# EAGLE design m220print (EAGLE 4.11)
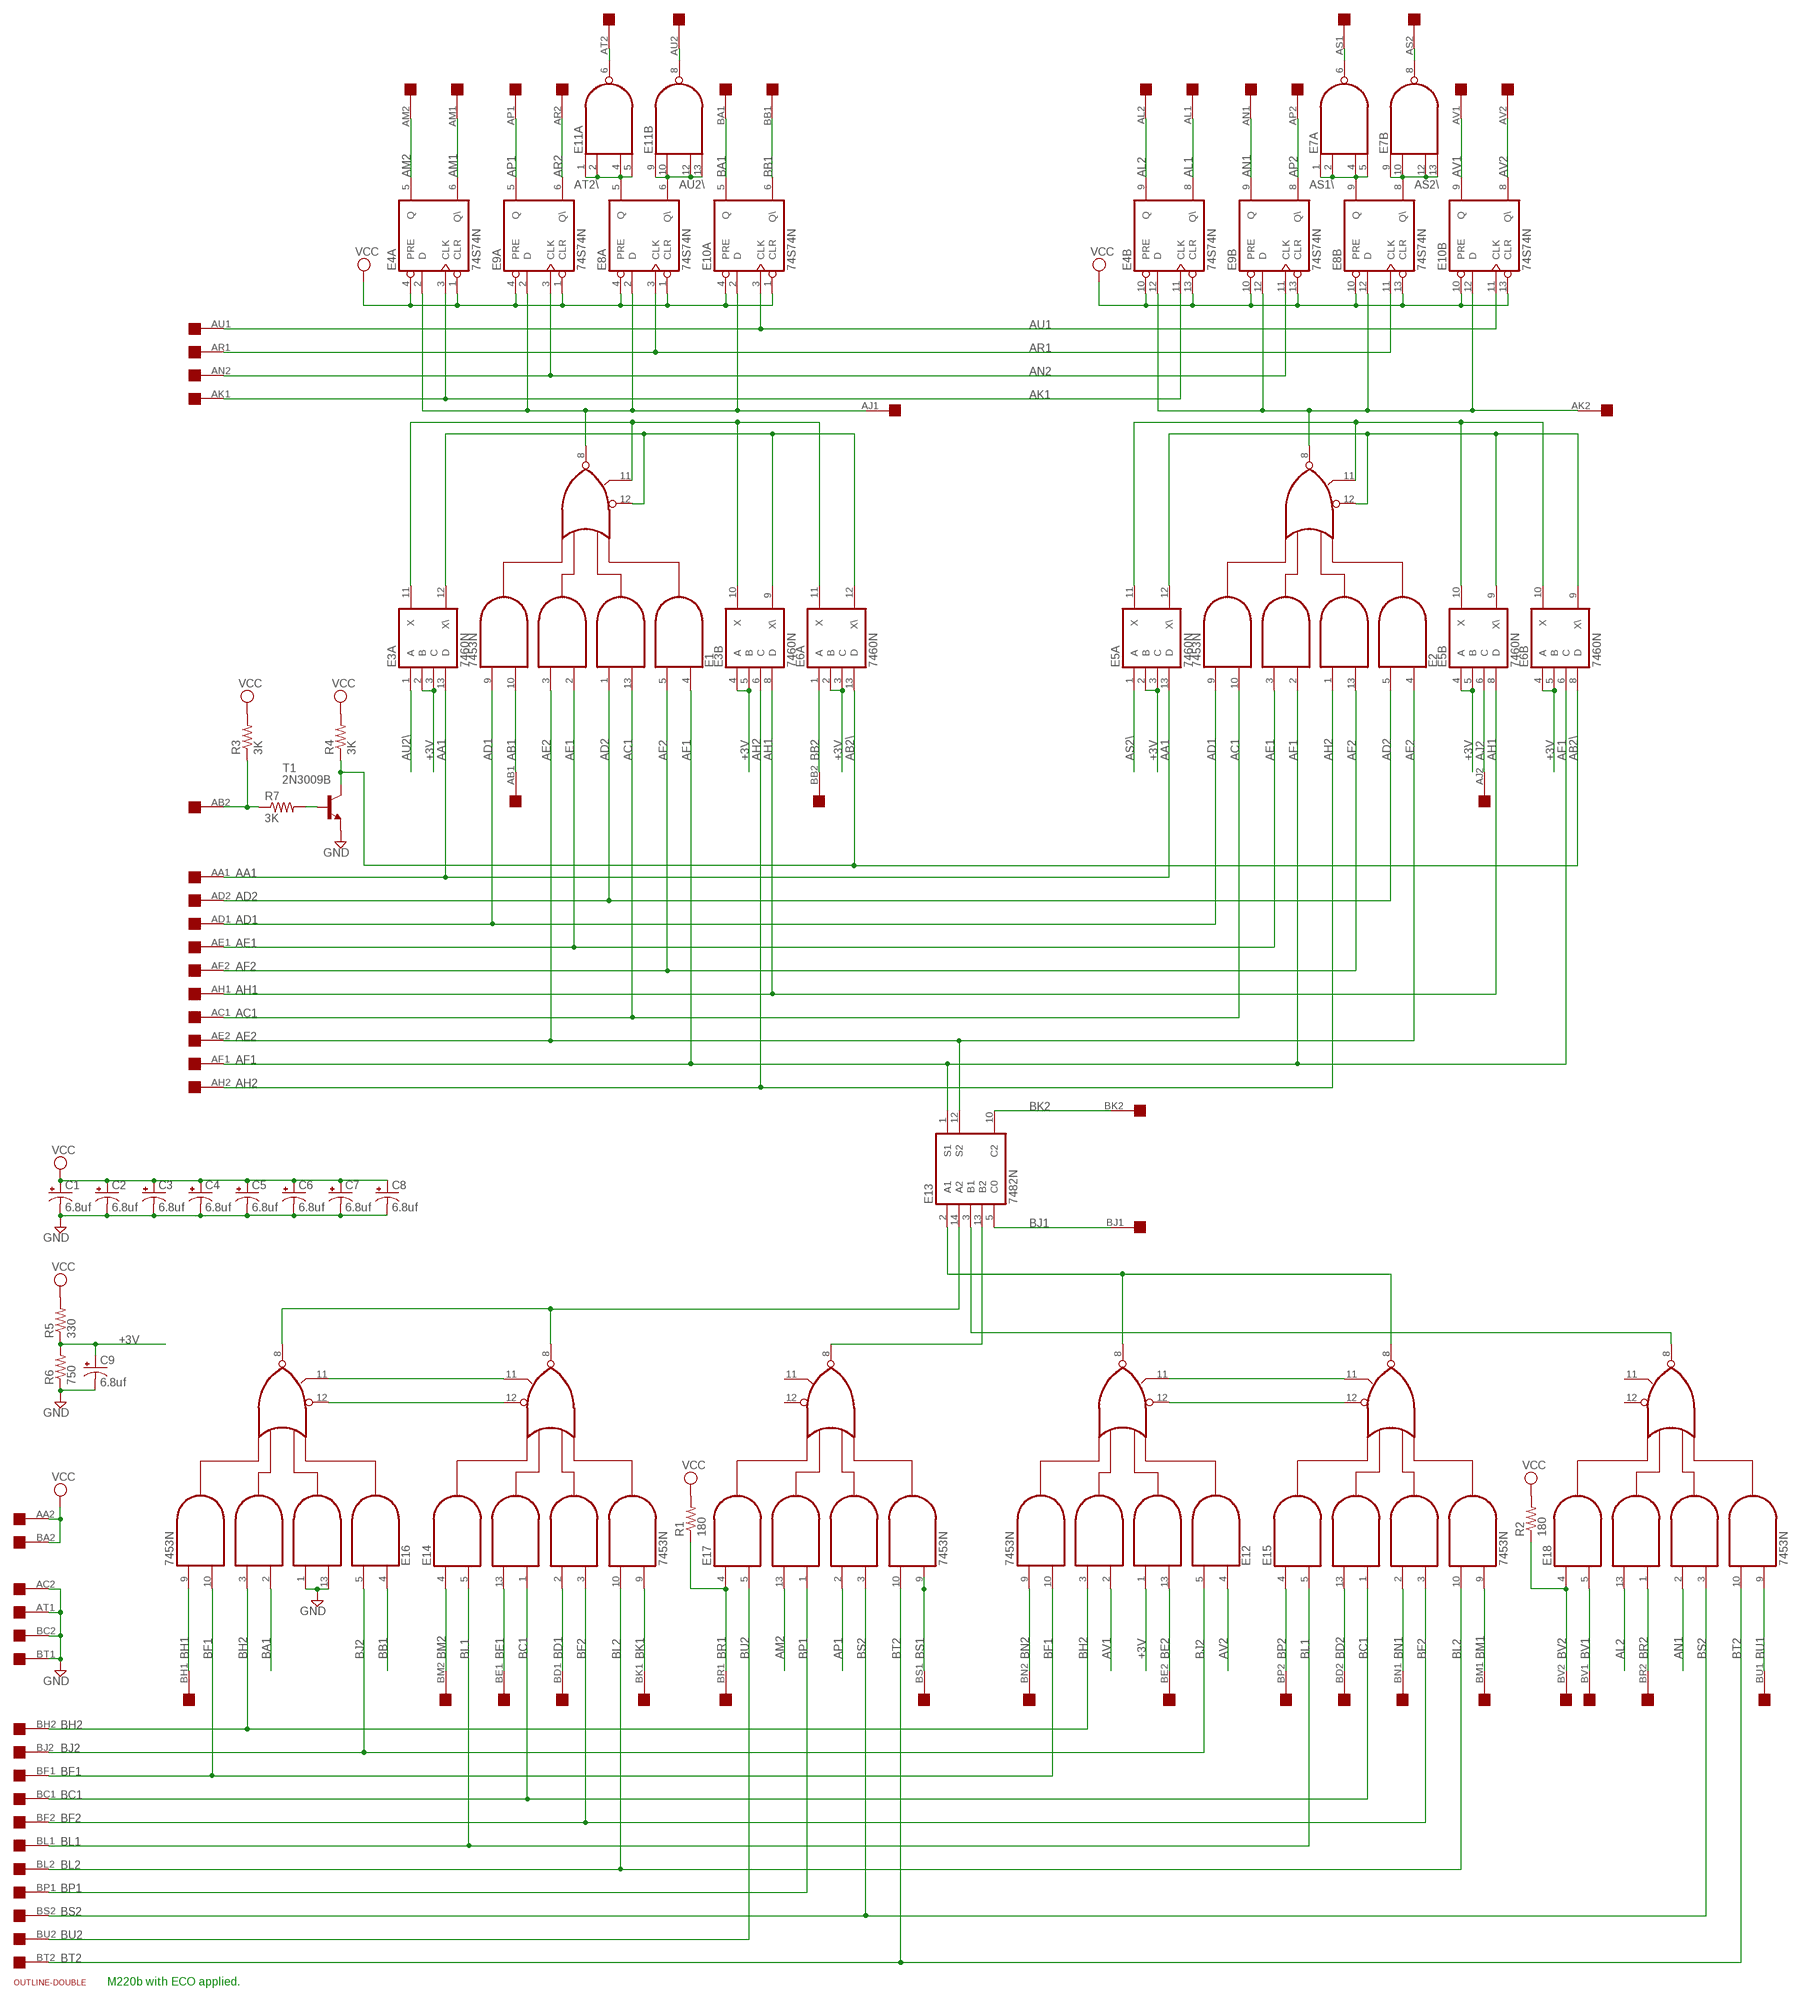
[diagram p0: schematic, sheet 1]

## Parts
C1  6.8uf  CPOL-USE15-5AXIAL  [E15-5]
C2  6.8uf  CPOL-USE15-5AXIAL  [E15-5]
C3  6.8uf  CPOL-USE15-5AXIAL  [E15-5]
C4  6.8uf  CPOL-USE15-5AXIAL  [E15-5]
C5  6.8uf  CPOL-USE15-5AXIAL  [E15-5]
C6  6.8uf  CPOL-USE15-5AXIAL  [E15-5]
C7  6.8uf  CPOL-USE15-5AXIAL  [E15-5]
C8  6.8uf  CPOL-USE15-5AXIAL  [E15-5]
C9  6.8uf  CPOL-USE15-5AXIAL  [E15-5]
E1  7453N  [DIL14]
E2  7453N  [DIL14]
E3  7460N  [DIL14]
E4  74S74N  [DIL14]
E5  7460N  [DIL14]
E6  7460N  [DIL14]
E7  74S20N  [DIL14]
E8  74S74N  [DIL14]
E9  74S74N  [DIL14]
E10  74S74N  [DIL14]
E11  74S20N  [DIL14]
E12  7453N  [DIL14]
E13  7482N  [DIL14]
E14  7453N  [DIL14]
E15  7453N  [DIL14]
E16  7453N  [DIL14]
E17  7453N  [DIL14]
E18  7453N  [DIL14]
R1  180  R-US_0207/10  [0207/10]
R2  180  R-US_0207/10  [0207/10]
R3  3K  R-US_0207/10  [0207/10]
R4  3K  R-US_0207/10  [0207/10]
R5  330  R-US_0207/10  [0207/10]
R6  750  R-US_0207/10  [0207/10]
R7  3K  R-US_0207/10  [0207/10]
T1  2N3009B  2N1613  [TO5]
U$1  DOUBLE  [EDGE-CON4]
U$2  OUTLINE-DOUBLE  [DOUBLE]

## Nets
+3V: C9.+ E3.2(A:B) E3.3(A:C) E3.4(B:A) E3.5(B:B) E5.2(A:B) E5.3(A:C) E5.4(B:A) E5.5(B:B) E6.2(A:B) E6.3(A:C) E6.4(B:A) E6.5(B:B) E12.1(I4) R5.1 R6.2
AA1: E3.13(A:D) E5.13(A:D) U$1.AA1
AB1: E1.10(I7) U$1.AB1
AB2: R3.1 R7.1 U$1.AB2
AB2\: E6.8(B:D) E6.13(A:D) R4.1 T1.3(C)
AC1: E1.13(I3) E2.10(I7) U$1.AC1
AD1: E1.9(I8) E2.9(I8) U$1.AD1
AD2: E1.1(I4) E2.5(I2) U$1.AD2
AE1: E1.2(I5) E2.3(I6) U$1.AE1
AE2: E1.3(I6) E2.4(I1) E13.12(S2) U$1.AE2
AF1: E1.4(I1) E2.2(I5) E6.6(B:C) E13.1(S1) U$1.AF1
AF2: E1.5(I2) E2.13(I3) U$1.AF2
AH1: E3.8(B:D) E5.8(B:D) U$1.AH1
AH2: E2.1(I4) E3.6(B:C) U$1.AH2
AJ1: E1.8(O) E4.2(A:D) E8.2(A:D) E9.2(A:D) E10.2(A:D) U$1.AJ1
AJ2: E5.6(B:C) U$1.AJ2
AK1: E4.3(A:CLK) E4.11(B:CLK) U$1.AK1
AK2: E2.8(O) E4.12(B:D) E8.12(B:D) E9.12(B:D) E10.12(B:D) U$1.AK2
AL1: E4.8(B:Q\) U$1.AL1
AL2: E4.9(B:Q) E18.13(I3) U$1.AL2
AM1: E4.6(A:Q\) U$1.AM1
AM2: E4.5(A:Q) E17.13(I3) U$1.AM2
AN1: E9.9(B:Q) E18.2(I5) U$1.AN1
AN2: E9.3(A:CLK) E9.11(B:CLK) U$1.AN2
AP1: E9.5(A:Q) E17.2(I5) U$1.AP1
AP2: E9.8(B:Q\) U$1.AP2
AR1: E8.3(A:CLK) E8.11(B:CLK) U$1.AR1
AR2: E9.6(A:Q\) U$1.AR2
AS1: E7.6(A:O) U$1.AS1
AS1\: E7.1(A:I0) E7.2(A:I1) E7.4(A:I2) E7.5(A:I3) E8.9(B:Q)
AS2: E7.8(B:O) U$1.AS2
AS2\: E5.1(A:A) E7.9(B:I0) E7.10(B:I1) E7.12(B:I2) E7.13(B:I3) E8.8(B:Q\)
AT2: E11.6(A:O) U$1.AT2
AT2\: E8.5(A:Q) E11.1(A:I0) E11.2(A:I1) E11.4(A:I2) E11.5(A:I3)
AU1: E10.3(A:CLK) E10.11(B:CLK) U$1.AU1
AU2: E11.8(B:O) U$1.AU2
AU2\: E3.1(A:A) E8.6(A:Q\) E11.9(B:I0) E11.10(B:I1) E11.12(B:I2) E11.13(B:I3)
AV1: E10.9(B:Q) E12.2(I5) U$1.AV1
AV2: E10.8(B:Q\) E12.4(I1) U$1.AV2
BA1: E10.5(A:Q) E16.2(I5) U$1.BA1
BB1: E10.6(A:Q\) E16.4(I1) U$1.BB1
BB2: E6.1(A:A) U$1.BB2
BC1: E14.1(I4) E15.1(I4) U$1.BC1
BD1: E14.2(I5) U$1.BD1
BD2: E15.13(I3) U$1.BD2
BE1: E14.13(I3) U$1.BE1
BE2: E12.13(I3) U$1.BE2
BF1: E12.10(I7) E16.10(I7) U$1.BF1
BF2: E14.3(I6) E15.3(I6) U$1.BF2
BH1: E16.9(I8) U$1.BH1
BH2: E12.3(I6) E16.3(I6) U$1.BH2
BJ1: E13.5(C0) U$1.BJ1
BJ2: E12.5(I2) E16.5(I2) U$1.BJ2
BK1: E14.9(I8) U$1.BK1
BK2: E13.10(C2) U$1.BK2
BL1: E14.5(I2) E15.5(I2) U$1.BL1
BL2: E14.10(I7) E15.10(I7) U$1.BL2
BM1: E15.9(I8) U$1.BM1
BM2: E14.4(I1) U$1.BM2
BN1: E15.2(I5) U$1.BN1
BN2: E12.9(I8) U$1.BN2
BP1: E17.1(I4) U$1.BP1
BP2: E15.4(I1) U$1.BP2
BR1: E17.4(I1) R1.1 U$1.BR1
BR2: E18.1(I4) U$1.BR2
BS1: E17.9(I8) U$1.BS1
BS2: E17.3(I6) E18.3(I6) U$1.BS2
BT2: E17.10(I7) E18.10(I7) U$1.BT2
BU1: E18.9(I8) U$1.BU1
BU2: E17.5(I2) U$1.BU2
BV1: E18.5(I2) U$1.BV1
BV2: E18.4(I1) R2.1 U$1.BV2
GND: C1.- C2.- C3.- C4.- C5.- C6.- C7.- C8.- C9.- E16.1(I4) E16.13(I3) R6.1 T1.1(E) U$1.AC2 U$1.AT1 U$1.BC2 U$1.BT1
N$2: E12.12(I9) E15.12(I9)
N$3: R7.2 T1.2(B)
N$4: E12.11(I10) E15.11(I10)
N$5: E13.14(A2) E14.8(O) E16.8(O)
N$6: E14.11(I10) E16.11(I10)
N$7: E14.12(I9) E16.12(I9)
N$8: E12.8(O) E13.2(A1) E15.8(O)
N$9: E2.12(I9) E5.9(B:X\) E5.12(A:X\) E6.9(B:X\)
N$10: E1.12(I9) E3.9(B:X\) E3.12(A:X\) E6.12(A:X\)
N$11: E2.11(I10) E5.10(B:X) E5.11(A:X) E6.10(B:X)
N$12: E13.13(B2) E17.8(O)
N$13: E1.11(I10) E3.10(B:X) E3.11(A:X) E6.11(A:X)
N$14: E13.3(B1) E18.8(O)
VCC: C1.+ C2.+ C3.+ C4.+ C5.+ C6.+ C7.+ C8.+ E4.1(A:CLR) E4.4(A:PRE) E4.10(B:PRE) E4.13(B:CLR) E8.1(A:CLR) E8.4(A:PRE) E8.10(B:PRE) E8.13(B:CLR) E9.1(A:CLR) E9.4(A:PRE) E9.10(B:PRE) E9.13(B:CLR) E10.1(A:CLR) E10.4(A:PRE) E10.10(B:PRE) E10.13(B:CLR) R1.2 R2.2 R3.2 R4.2 R5.2 U$1.AA2 U$1.BA2
Unconnected: E17.11(I10) E17.12(I9) E18.11(I10) E18.12(I9)

## Notes on the sheet
- M220b with ECO applied.

## Power pins joined to a net without a drawn wire
GND: E1.7(GND) E2.7(GND) E3.7(P:GND) E4.7(P:GND) E5.7(P:GND) E6.7(P:GND) E7.7(P:GND) E8.7(P:GND) E9.7(P:GND) E10.7(P:GND) E11.7(P:GND) E12.7(GND) E13.7(GND) E14.7(GND) E15.7(GND) E16.7(GND) E17.7(GND) E18.7(GND)
VCC: E1.14(VCC) E2.14(VCC) E3.14(P:VCC) E4.14(P:VCC) E5.14(P:VCC) E6.14(P:VCC) E7.14(P:VCC) E8.14(P:VCC) E9.14(P:VCC) E10.14(P:VCC) E11.14(P:VCC) E12.14(VCC) E13.4(VCC) E14.14(VCC) E15.14(VCC) E16.14(VCC) E17.14(VCC) E18.14(VCC)

## Library data of the parts
C1-C9 = rcl:CPOL-US: POLARIZED CAPACITOR, American symbol
E1 E2 E12 E14-E18 = 74xxN:74*53: 4-2-3-2 input AND OR INVERTER gates
E3 E5 E6 = 74xx-jameco:74*60: Dual 4-input EXPANDER
E4 E8-E10 = 74xx-us:74*74: Dual D type positive edge triggered FLIP FLOP, preset and clear
E7 E11 = 74xx-jameco:74*20: Dual 4-input NAND gate
E13 = 74xx-eu:74*82: 2-bit binary full ADDER
R1-R7 = rcl:R-US_: RESISTOR, American symbol
T1 = transistor:2N1613: NPN TRANSISTOR
U$1 = dec-con:DOUBLE: Double-Height DEC board
U$2 = dec-con:OUTLINE-*: Board outlines for DEC boards.

## Board
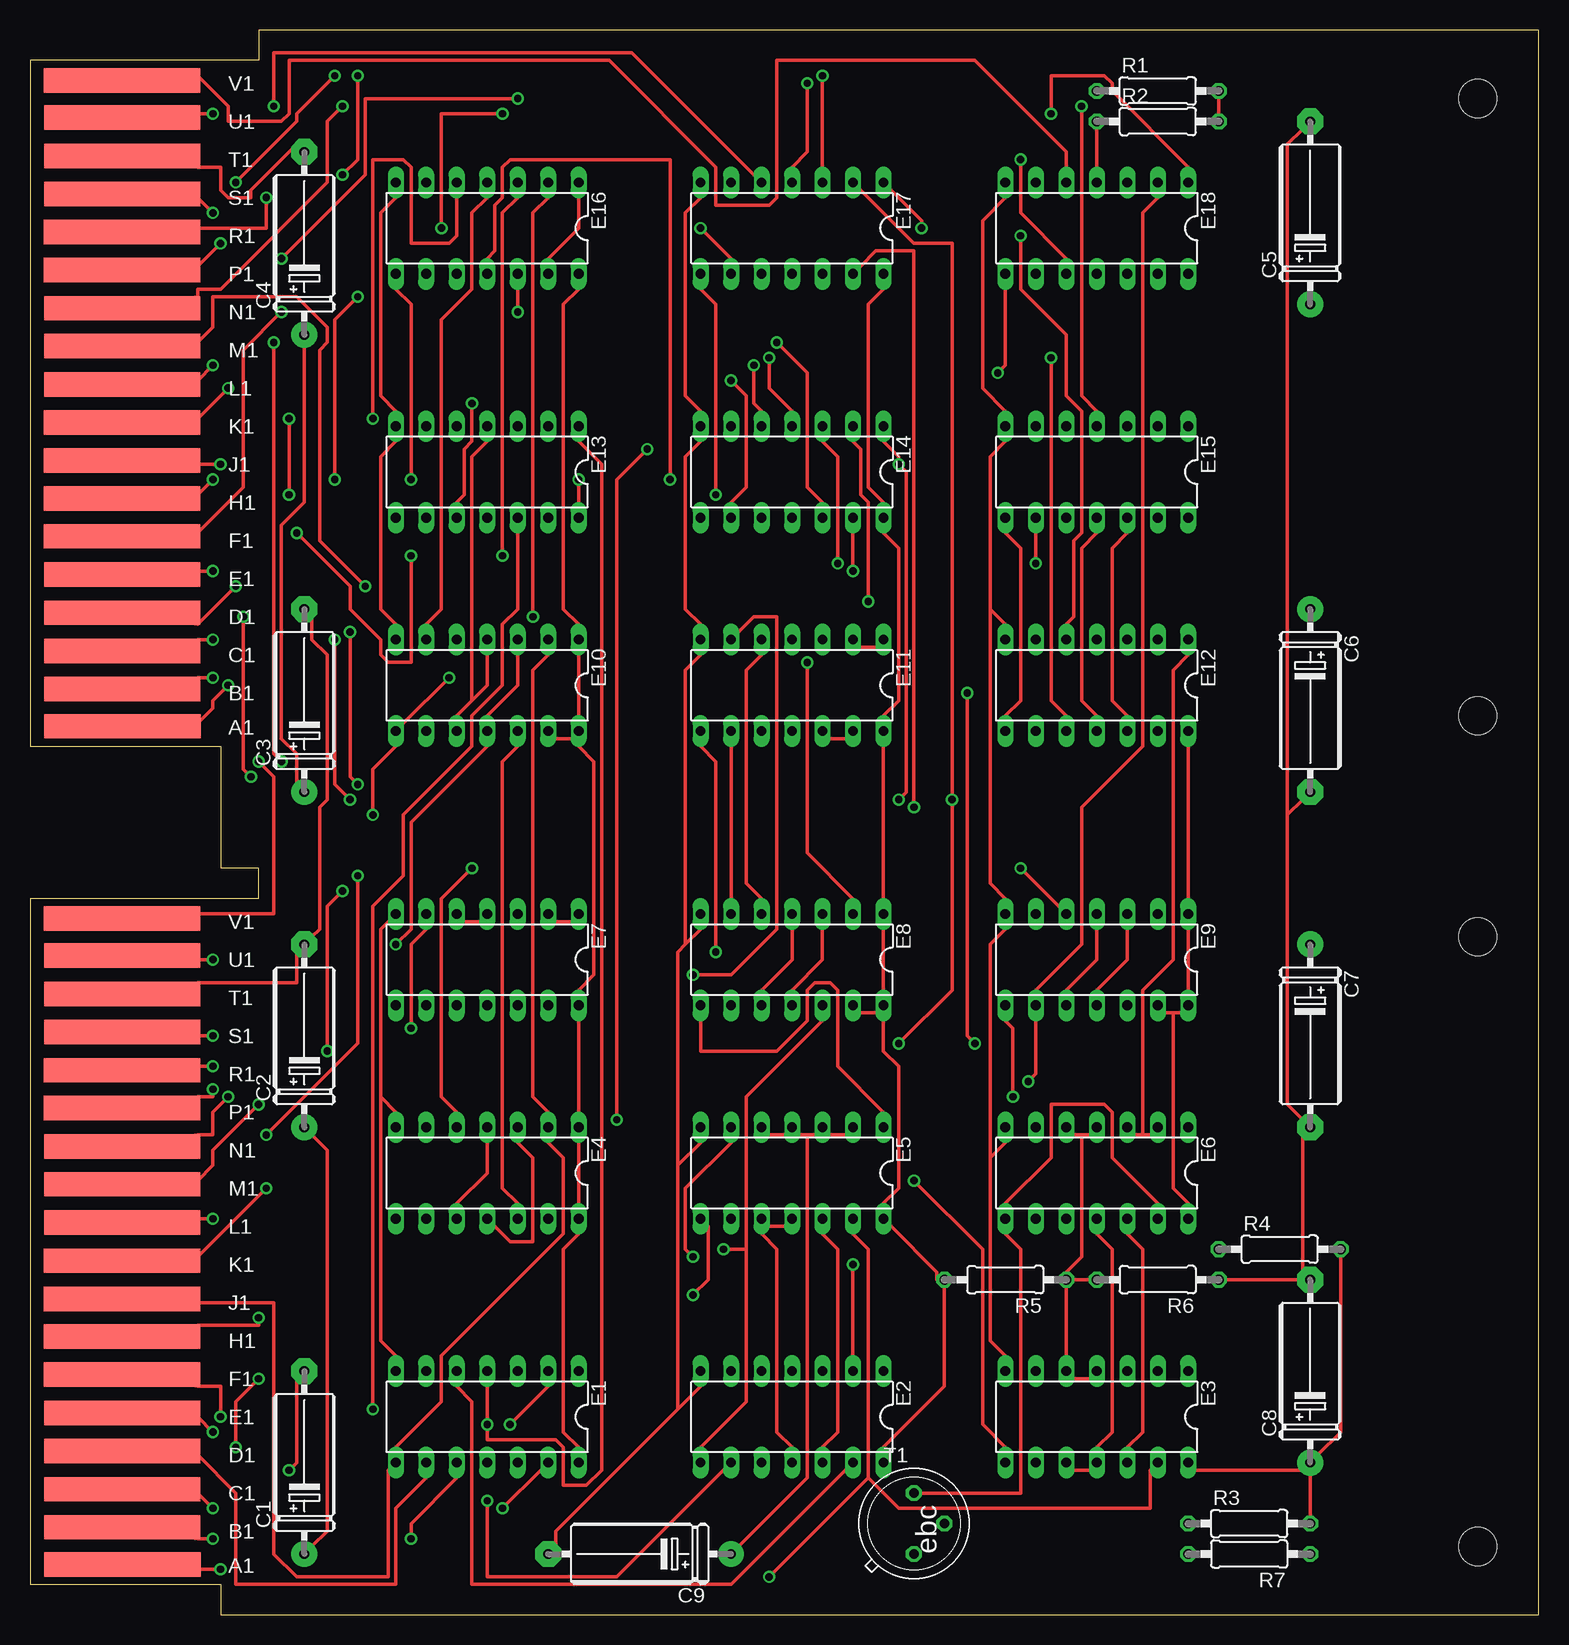
[diagram p1: board, top side]
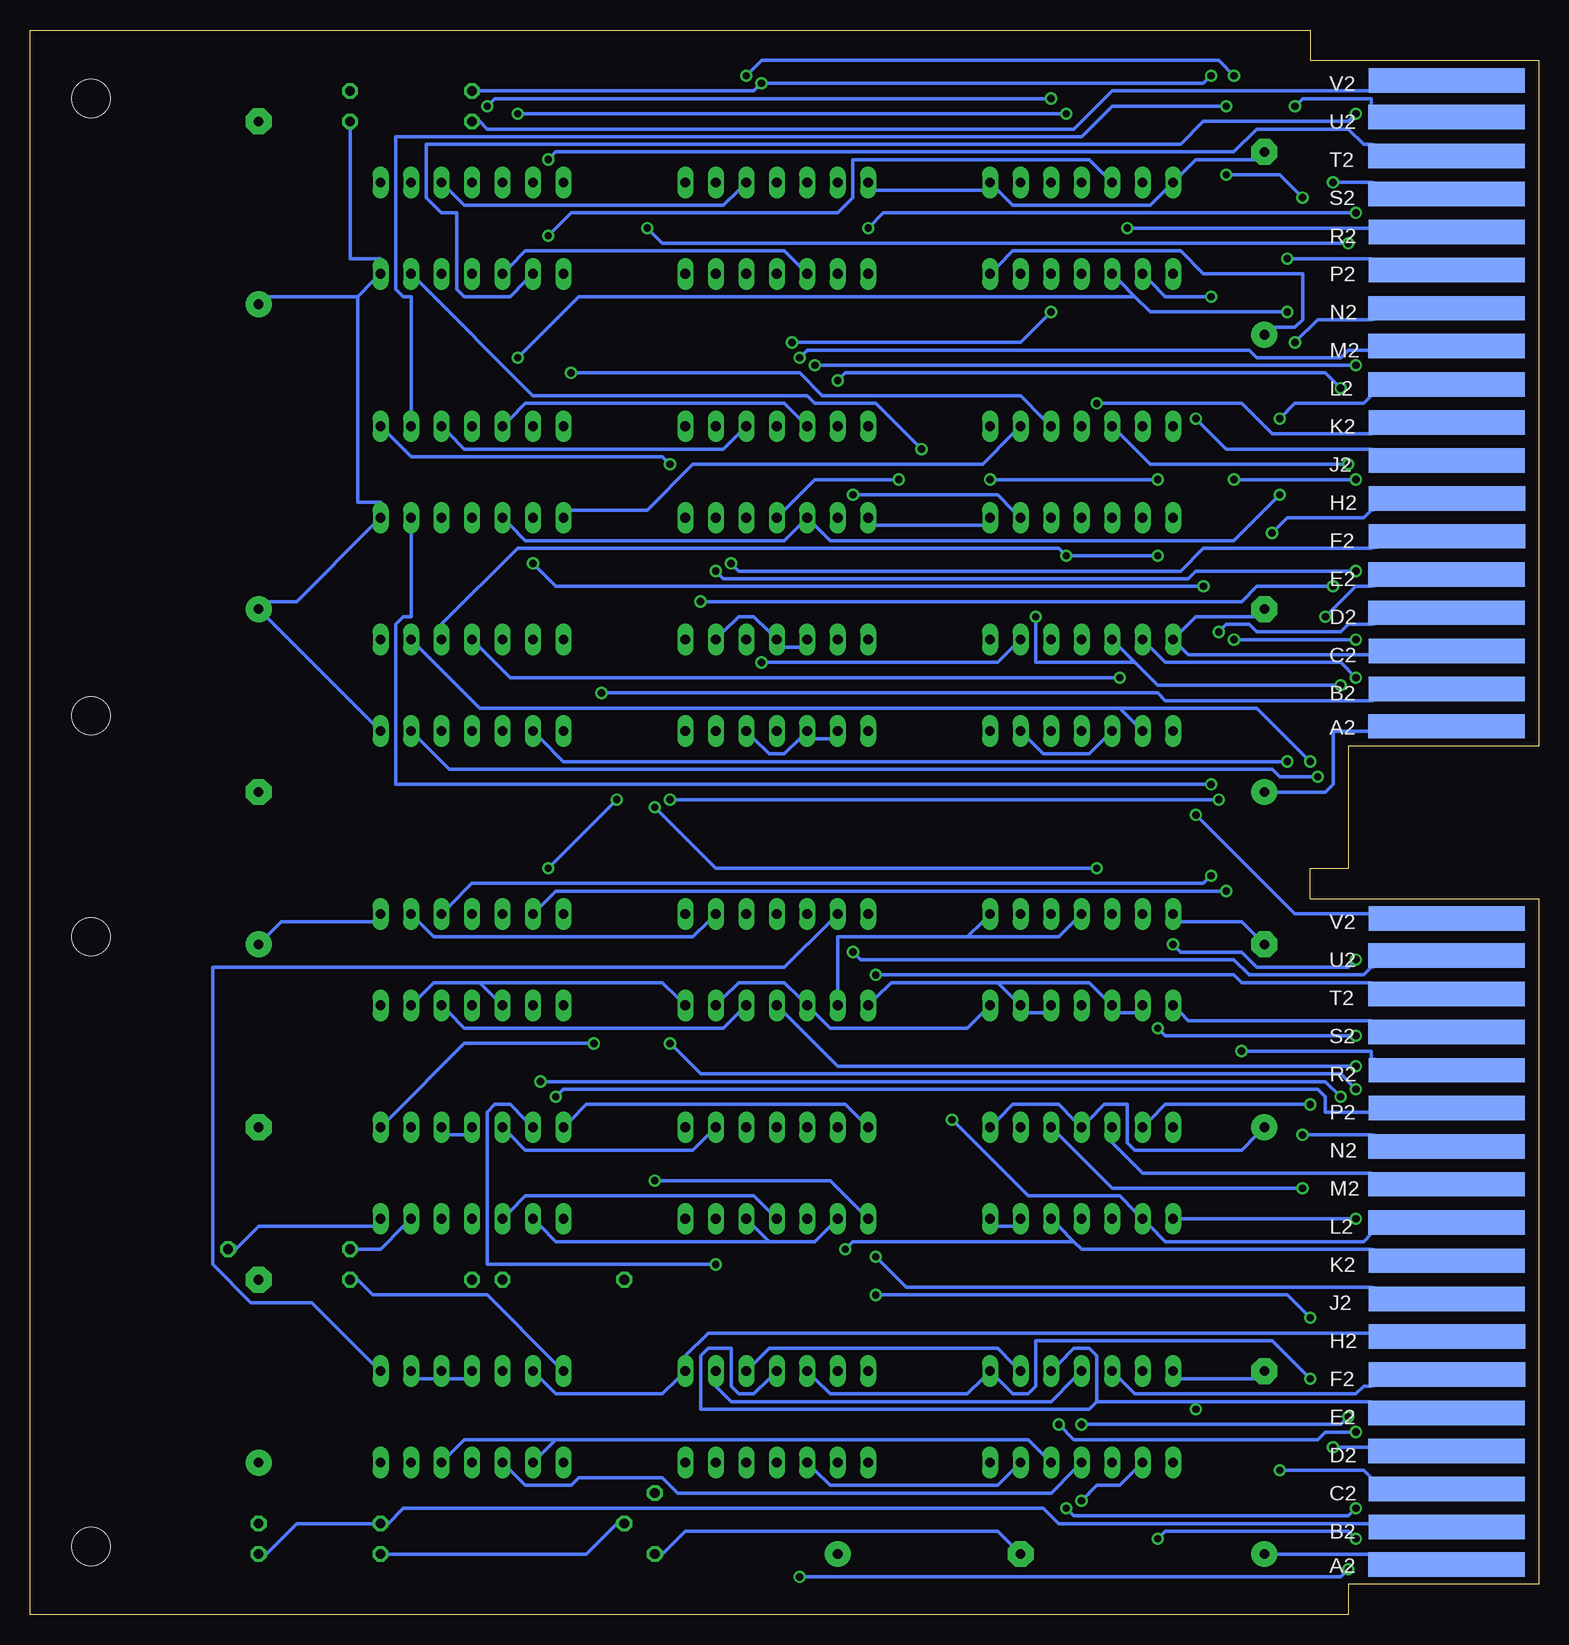
[diagram p2: board, bottom side, seen from below]

Size 125.73 x 132.08 mm. Coordinates in mm from the lower left corner, seen from the top.
Copper layers (1*16): Top 0.035mm / dielectric 1.5mm / Bottom 0.035mm
Design rules "olimex10mil": minimum track width 12mil, minimum drill 24mil, track to track 12mil, track to pad 12mil, pad to pad 12mil, via to via 12mil, smd to smd 10mil, copper to edge 25mil, drill to drill 10mil, minimum pad ring 10mil, minimum via ring 8mil, stop-mask expansion 0mil, vias tented up to drill 0mil, thermal gap 10mil

### Footprints (pad centres in the part's own frame; a part is rotated, then mirrored left to right if it is on the bottom)
E15-5 = drill 0.813 pad 2.159 round: + -7.62,0 | drill 0.813 pad 2.159 octagon: - 7.62,0
DIL14 = drill 0.813 long: 1 -7.62,-3.81; 2 -5.08,-3.81; 3 -2.54,-3.81; 4 0,-3.81; 5 2.54,-3.81; 6 5.08,-3.81; 7 7.62,-3.81; 8 7.62,3.81; 9 5.08,3.81; 10 2.54,3.81; 11 0,3.81; 12 -2.54,3.81; 13 -5.08,3.81; 14 -7.62,3.81
0207/10 = drill 0.813 octagon: 1 -5.08,0; 2 5.08,0
TO5 = drill 0.813 octagon: 1 0,-2.54; 2 2.54,0; 3 0,2.54
EDGE-CON4 = smd 13.017 x 2.032: AA1 7.709,4.207; AB1 7.684,7.312; AC1 7.684,10.474; AD1 7.684,13.665; AE1 7.693,16.84; AF1 7.668,20.041; AH1 7.668,23.19; AJ1 7.668,26.34; AK1 7.668,29.515; AL1 7.693,32.69; AM1 7.693,35.89; AN1 7.693,39.04; AP1 7.668,42.24; AR1 7.668,45.39; AS1 7.693,48.565; AT1 7.693,51.74; AU1 7.693,54.94; AV1 7.668,58.026; BA1 7.709,74.057; BB1 7.684,77.162; BC1 7.684,80.324; BD1 7.684,83.515; BE1 7.693,86.69; BF1 7.668,89.891; BH1 7.668,93.04; BJ1 7.668,96.19; BK1 7.668,99.365; BL1 7.693,102.54; BM1 7.693,105.74; BN1 7.693,108.89; BP1 7.668,112.09; BR1 7.668,115.24; BS1 7.693,118.415; BT1 7.693,121.59; BU1 7.693,124.79; BV1 7.668,127.876 | smd 13.017 x 2.032 bottom: AA2 7.69,4.207; AB2 7.668,7.328; AC2 7.668,10.49; AD2 7.693,13.665; AE2 7.693,16.84; AF2 7.642,20.041; AH2 7.642,23.19; AJ2 7.668,26.34; AK2 7.668,29.515; AL2 7.693,32.69; AM2 7.693,35.89; AN2 7.693,39.04; AP2 7.668,42.24; AR2 7.668,45.39; AS2 7.693,48.565; AT2 7.693,51.74; AU2 7.693,54.966; AV2 7.668,58.026; BA2 7.69,74.057; BB2 7.668,77.178; BC2 7.668,80.34; BD2 7.693,83.515; BE2 7.693,86.69; BF2 7.642,89.891; BH2 7.642,93.04; BJ2 7.668,96.19; BK2 7.668,99.365; BL2 7.693,102.54; BM2 7.693,105.74; BN2 7.693,108.89; BP2 7.668,112.09; BR2 7.668,115.24; BS2 7.693,118.415; BT2 7.693,121.59; BU2 7.693,124.816; BV2 7.668,127.876
DOUBLE = hole 3.175: 120.65,56.515; 120.65,5.715; 120.65,74.93; 120.65,126.365

### Placement (x,y rotation side)
C1  22.86,12.7 90 top
C2  22.86,48.26 90 top
C3  22.86,76.2 90 top
C4  22.86,114.3 90 top
C5  106.68,116.84 90 top
C6  106.68,76.2 270 top
C7  106.68,48.26 270 top
C8  106.68,20.32 90 top
C9  50.8,5.08 180 top
E1  38.1,16.51 180 top
E2  63.5,16.51 180 top
E3  88.9,16.51 180 top
E4  38.1,36.83 180 top
E5  63.5,36.83 180 top
E6  88.9,36.83 180 top
E7  38.1,54.61 180 top
E8  63.5,54.61 180 top
E9  88.9,54.61 180 top
E10  38.1,77.47 180 top
E11  63.5,77.47 180 top
E12  88.9,77.47 180 top
E13  38.1,95.25 180 top
E14  63.5,95.25 180 top
E15  88.9,95.25 180 top
E16  38.1,115.57 180 top
E17  63.5,115.57 180 top
E18  88.9,115.57 180 top
R1  93.98,127 0 top
R2  93.98,124.46 0 top
R3  101.6,7.62 0 top
R4  104.14,30.48 0 top
R5  81.28,27.94 180 top
R6  93.98,27.94 180 top
R7  101.6,5.08 180 top
T1  73.66,7.62 0 top
U$1  0,0 0 top
U$2  0,0 0 top

### Tracks (layer width: path | path; a pad name or v marks a point on that pad's centre or on a via)
+3V
  Top 0.305: E5.5 61.6,40.01 62.87,40.01 E5.4 64.14,40.01 64.77,40.01 | 64.77,40.01 65.41,40.01 E5.3 66.68,40.01 67.95,40.01 E5.2 | 64.77,40.01 64.77,11.43 59.06,5.71 C9.+ | R5.1 87,27.94 88.27,27.94 R6.2 | E3.4 88.27,19.68 87,19.68 E3.5 86.36,21.59 86.36,27.3 R5.1 | 87.63,40.01 88.27,40.01 E6.4 | 87.63,40.01 87,40.01 E6.5 | 92.71,40.01 92.08,40.01 E6.3 | 92.71,40.01 93.35,40.01 E6.2 | 92.71,40.01 92.71,52.07 95.25,54.61 95.25,78.74 96.52,80.01 E12.1 | 87.63,40.01 87.63,29.84 86.36,28.57 R5.1
  Bottom 0.305: E3.4 89.54,19.68 90.81,19.68 E3.3 92.08,19.68 93.35,19.68 E3.2 | E6.3 90.81,40.01 89.54,40.01 E6.4 | E5.2 69.22,40.01 70.49,38.73 84.46,38.73 85.73,40.01 E6.5
AA1  (via drill 0.61)
  Top 0.305: 69.85,11.43 69.85,30.48 68.58,31.75 E5.13 | 69.85,11.43 72.39,8.89 93.35,8.89 93.35,12.06 E3.13 | v15.88,3.81 13.97,3.81 U$1.AA1 | v61.6,3.17 69.85,11.43
  Bottom 0.305: v15.88,3.81 16.51,3.17 v61.6,3.17
AB1  (via drill 0.61)
  Top 0.305: v31.75,6.35 31.75,7.62 35.56,11.43 E1.10 | v15.24,6.35 13.97,6.35 U$1.AB1
  Bottom 0.305: v31.75,6.35 31.12,6.99 15.88,6.99 v15.24,6.35
AB2
  Bottom 0.305: R7.1 106.05,5.08 103.51,7.62 97.16,7.62 R3.1 95.89,7.62 94.62,8.89 41.28,8.89 40.01,7.62 13.97,7.62 U$1.AB2
AB2\
  Top 0.305: T1.3 74.3,10.16 82.55,10.16 82.55,30.48 81.28,31.75 E6.8 81.28,34.29 85.09,38.1 85.09,42.55 89.54,42.55 90.17,41.91 90.17,38.1 93.98,34.29 E6.13
  Bottom 0.305: E6.13 94.62,32.38 96.52,30.48 98.43,30.48 R4.1
AC1  (via drill 0.61)
  Top 0.305: v39.37,8.89 42.55,12.06 E1.13 | v15.24,8.89 13.97,10.16 U$1.AC1
  Bottom 0.305: E1.13 43.82,12.06 45.09,10.79 59.06,10.79 60.33,12.06 E2.10 | v39.37,8.89 38.74,8.26 15.88,8.26 v15.24,8.89
AD1  (via drill 0.61)
  Top 0.305: E1.9 33.02,11.43 30.48,8.89 30.48,2.54 17.15,2.54 17.15,10.16 13.97,13.34 U$1.AD1 | v38.1,9.53 38.1,3.17 48.9,3.17 57.79,12.06 E2.9
  Bottom 0.305: v38.1,9.53 36.83,10.79 34.93,10.79 33.66,12.06 E1.9
AD2  (via drill 0.61)
  Top 0.305: v19.05,19.68 17.15,17.78 v17.15,13.97
  Bottom 0.305: E2.5 60.33,19.68 59.06,18.41 47.63,18.41 46.36,19.68 E1.1 45.09,19.68 43.82,18.41 42.55,18.41 41.91,19.05 41.91,22.86 22.23,22.86 v19.05,19.68 | v17.15,13.97 13.97,13.97 U$1.AD2
AE1  (via drill 0.61)
  Top 0.305: v40.01,15.88 43.18,19.05 E1.2 | v15.24,15.24 13.97,16.51 U$1.AE1
  Bottom 0.305: E1.2 43.82,20.95 45.09,22.23 64.14,22.23 65.41,20.95 E2.3 | v40.01,15.88 38.74,14.61 18.42,14.61 17.78,15.24 v15.24,15.24
AE2  (via drill 0.61)
  Top 0.305: v28.58,17.14 28.58,59.05 31.12,61.59 31.12,66.67 36.83,72.39 36.83,74.93 39.37,77.47 39.37,82.55 40.64,83.82 40.64,90.17 E13.12
  Bottom 0.305: 36.83,17.78 36.83,21.59 37.47,22.23 38.74,22.23 40.01,20.95 E1.3 | 28.58,17.78 13.97,17.78 U$1.AE2 | 28.58,17.78 36.83,17.78 | 36.83,17.78 37.47,17.14 69.85,17.14 69.85,21.59 69.22,22.23 67.31,22.23 67.31,19.05 66.68,18.41 65.41,18.41 64.14,19.68 E2.4 | 28.58,17.78 v28.58,17.14
AF1  (via drill 0.61)
  Top 0.305: v68.58,29.21 68.58,21.59 E2.2 | E13.1 45.72,97.79 47.63,95.89 47.63,12.06 46.36,10.79 44.45,10.79 44.45,13.97 43.82,14.61 38.1,14.61 v38.1,15.88 38.1,19.05 E1.4 | v15.88,16.51 15.88,19.05 13.97,19.05 U$1.AF1
  Bottom 0.305: E1.4 38.74,19.68 40.64,17.78 67.31,17.78 68.58,19.05 E2.2 | v68.58,29.21 87.63,29.21 87.63,41.91 87,42.55 85.73,42.55 84.46,41.27 E6.6 | v15.88,16.51 16.51,15.88 v38.1,15.88
AF2
  Top 0.305: E2.13 67.95,12.06 58.42,2.54 36.83,2.54 36.83,17.78 35.56,19.05 E1.5
  Bottom 0.305: E1.5 34.93,19.68 33.66,18.41 15.24,18.41 14.61,19.05 13.97,19.05 U$1.AF2
AH1  (via drill 0.61)
  Top 0.305: v73.66,36.2 79.38,30.48 79.38,15.88 81.28,13.97 E3.8 | v19.05,24.77 19.05,24.13 13.97,24.13 U$1.AH1 | v55.25,26.67 56.52,27.94 56.52,32.38 E5.8
  Bottom 0.305: v73.66,36.2 59.06,36.2 56.52,33.66 E5.8 | v19.05,24.77 20.96,26.67 v55.25,26.67
AH2
  Bottom 0.305: E3.6 83.19,19.68 81.92,18.41 73.03,18.41 71.76,19.68 E2.1 71.12,21.59 69.22,23.5 13.97,23.5 U$1.AH2
AJ1  (via drill 0.61)
  Top 0.305: E10.2 43.18,80.01 41.91,78.74 41.91,43.18 43.18,41.91 E4.2 43.18,39.37 44.45,38.1 44.45,31.75 34.29,21.59 34.29,17.78 30.48,13.97 E1.8 29.85,12.06 29.85,3.17 22.23,3.17 20.32,5.08 20.32,26.04 13.97,26.04 U$1.AJ1 | v64.77,79.38 64.77,63.5 68.58,59.69 E8.2
  Bottom 0.305: E8.2 69.22,57.78 70.49,56.52 92.08,56.52 93.35,57.78 E9.2 | v64.77,79.38 45.09,79.38 43.82,80.64 E10.2
AJ2  (via drill 0.61)
  Top 0.305: v55.25,29.84 54.61,30.48 54.61,35.56 58.42,39.37 E5.6
  Bottom 0.305: v55.25,29.84 52.71,27.3 13.97,27.3 U$1.AJ2
AK1  (via drill 0.61)
  Top 0.305: E4.11 38.74,32.38 40.01,31.11 41.91,31.11 41.91,38.1 40.64,39.37 E4.3 | v19.69,35.56 13.97,29.84 U$1.AK1
  Bottom 0.305: v19.69,35.56 35.56,35.56 40.01,40.01 E4.3
AK2  (via drill 0.61)
  Top 0.305: 59.69,30.48 59.69,43.18 66.04,49.53 E8.12 | 59.69,30.48 59.69,17.78 55.88,13.97 E2.8 | E10.12 40.64,72.39 39.37,71.12 39.37,35.56 40.64,34.29 E4.12 | v57.79,30.48 59.69,30.48
  Bottom 0.305: E9.12 90.81,50.16 89.54,48.9 67.95,48.9 66.68,50.16 E8.12 | 38.74,31.11 38.1,30.48 13.97,30.48 U$1.AK2 | 38.74,31.11 40.01,32.38 E4.12 | v57.79,30.48 57.15,31.11 38.74,31.11
AL1  (via drill 0.61)
  Top 0.305: v15.24,33.02 13.97,33.02 U$1.AL1
  Bottom 0.305: v15.24,33.02 29.85,33.02 E4.8
AL2  (via drill 0.61)
  Top 0.305: v51.44,97.16 48.9,94.61 v48.9,41.27
  Bottom 0.305: U$1.AL2 13.97,31.75 14.61,31.11 31.12,31.11 32.39,32.38 E4.9 33.66,33.66 34.93,34.92 42.55,34.92 v48.9,41.27 | v51.44,97.16 55.25,100.97 60.33,100.97 60.96,101.6 83.82,101.6 93.35,111.12 E18.13
AM1  (via drill 0.61)
  Top 0.305: v19.05,42.55 15.24,38.73 15.24,37.47 13.97,36.2 U$1.AM1
  Bottom 0.305: v19.05,42.55 31.12,42.55 32.39,41.27 E4.6
AM2  (via drill 0.61)
  Top 0.305: v73.66,67.31 73.66,113.67 70.49,113.67 69.22,112.39 E17.13 | v36.83,62.23 34.29,59.69 34.29,43.18 35.56,41.91 E4.5
  Bottom 0.305: E4.5 35.56,39.37 33.02,36.83 13.97,36.83 U$1.AM2 | v73.66,67.31 68.58,62.23 v36.83,62.23
AN1  (via drill 0.61)
  Top 0.305: E18.2 93.98,118.11 92.71,116.84 92.71,72.39 87.63,67.31 87.63,55.88 83.82,52.07 E9.9 83.82,49.53 83.82,45.09 v83.19,44.45 | v16.51,43.18 15.24,41.91 15.24,40.01 13.97,40.01 U$1.AN1
  Bottom 0.305: v16.51,43.18 17.78,44.45 v83.19,44.45
AN2  (via drill 0.61)
  Top 0.305: E9.11 88.9,52.07 91.44,54.61 91.44,57.15 E9.3 | v27.31,61.59 27.31,47.62 v19.69,40.01
  Bottom 0.305: v27.31,61.59 27.94,60.96 88.9,60.96 90.81,59.05 E9.3 | v19.69,40.01 13.97,40.01 U$1.AN2
AP1  (via drill 0.61)
  Top 0.305: v82.55,62.23 85.73,59.05 E9.5 | E17.2 69.22,118.75 73.66,114.3 76.84,114.3 v76.84,67.94 76.84,52.07 v72.39,47.62 | v15.24,43.81 15.24,43.18 13.97,43.18 U$1.AP1
  Bottom 0.305: v76.84,67.94 v82.55,62.23 | v15.24,43.81 16.51,45.09 69.85,45.09 v72.39,47.62
AP2  (via drill 0.61)
  Top 0.305: v81.92,43.18 81.92,48.9 81.28,49.53 E9.8
  Bottom 0.305: v81.92,43.18 81.28,43.81 18.42,43.81 17.78,43.18 17.78,41.91 13.97,41.91 U$1.AP2
AR1  (via drill 0.61)
  Top 0.305: E8.11 63.5,52.07 66.04,54.61 66.04,57.15 E8.3 | v15.24,45.72 13.97,45.72 U$1.AR1
  Bottom 0.305: v15.24,45.72 58.42,45.72 62.87,50.16 E8.11
AR2  (via drill 0.61)
  Top 0.305: v26.04,60.33 24.77,59.05 v24.77,46.99
  Bottom 0.305: v26.04,60.33 81.92,60.33 83.19,59.05 E9.6 | v24.77,46.99 13.97,46.99 13.97,46.35 U$1.AR2
AS1  (via drill 0.61)
  Top 0.305: v31.75,48.9 31.75,55.88 33.02,57.15 E7.6 | v15.24,48.26 13.97,48.26 U$1.AS1
  Bottom 0.305: v31.75,48.9 31.12,48.26 v15.24,48.26
AS1\
  Top 0.305: E7.5 36.2,57.78 37.47,57.78 E7.4 | E7.2 43.82,57.78 45.09,57.78 E7.1
  Bottom 0.305: 47.63,56.52 58.42,56.52 58.42,52.07 E8.9 | 47.63,56.52 46.36,57.78 E7.1 | 47.63,56.52 40.01,56.52 38.74,57.78 E7.4
AS2
  Bottom 0.305: E7.8 29.85,50.16 29.21,49.53 13.97,49.53 U$1.AS2
AS2\
  Top 0.305: E5.1 71.12,41.91 67.31,45.72 67.31,52.07 66.68,52.7 65.41,52.7 64.77,52.07 64.77,49.53 62.23,46.99 55.88,46.99 55.88,49.53 E8.8
  Bottom 0.305: E7.9 33.66,50.16 34.93,50.16 E7.10 36.2,51.44 37.47,52.7 45.09,52.7 | E7.12 41.28,50.16 42.55,50.16 E7.13 43.82,51.44 45.09,52.7 | 45.09,52.7 53.98,52.7 55.25,51.44 E8.8
AT2  (via drill 0.61)
  Top 0.305: v55.25,53.34 58.42,53.34 62.23,57.15 62.23,83.19 60.33,83.19 59.06,81.92 E11.6
  Bottom 0.305: v55.25,53.34 25.4,53.34 24.77,52.7 13.97,52.7 U$1.AT2
AT2\
  Top 0.305: E11.2 69.22,80.64 70.49,80.64 E11.1 | E8.5 60.96,59.69 59.69,60.96 59.69,78.74 60.96,80.01 E11.5
  Bottom 0.305: E11.5 61.6,80.64 62.87,80.64 E11.4 64.14,81.92 65.41,83.19 66.68,83.19 67.95,81.92 E11.2
AU1  (via drill 0.61)
  Top 0.305: E10.3 40.64,80.01 40.64,77.47 38.1,74.93 E10.11 38.1,72.39 31.75,66.04 31.75,57.15 v30.48,55.88 | v15.24,54.61 13.97,54.61 U$1.AU1
  Bottom 0.305: v30.48,55.88 29.85,55.24 24.77,55.24 23.5,53.98 15.88,53.98 v15.24,54.61
AU2  (via drill 0.61)
  Top 0.305: v57.15,55.24 57.15,71.12 55.88,72.39 E11.8
  Bottom 0.305: v57.15,55.24 56.52,54.61 25.4,54.61 24.13,53.34 14.61,53.34 13.97,53.98 U$1.AU2
AU2\
  Top 0.305: E11.12 66.68,73.03 67.95,73.03 E11.13 | E8.6 58.42,59.69 58.42,72.39 E11.9
  Bottom 0.305: E11.9 59.06,73.03 60.33,73.03 E11.10 61.6,73.03 62.87,71.75 64.14,71.75 65.41,73.03 E11.12 | E3.1 97.16,20.95 102.24,26.04 107.32,26.04 110.49,29.21 110.49,53.98 62.87,53.98 59.06,57.78 E8.6
AV1  (via drill 0.61)
  Top 0.305: v19.05,71.12 20.32,69.85 20.32,58.42 13.97,58.42 U$1.AV1
  Bottom 0.305: 34.93,75.56 33.66,74.3 E10.9 | 34.93,75.56 88.27,75.56 93.35,80.64 E12.2 | v19.05,71.12 23.5,75.56 34.93,75.56
AV2  (via drill 0.61)
  Top 0.305: v28.58,66.67 28.58,70.48 30.48,72.39 E10.8 31.12,74.3 v34.93,78.11
  Bottom 0.305: v28.58,66.67 20.32,58.42 13.97,58.42 U$1.AV2 | v34.93,78.11 85.73,78.11 88.27,80.64 E12.4
BA1  (via drill 0.61)
  Top 0.305: v16.51,77.47 15.24,76.2 15.24,75.56 13.97,74.3 U$1.BA1 | v41.91,83.19 41.91,116.84 43.18,118.11 E16.2
  Bottom 0.305: 33.66,79.38 31.75,77.47 v16.51,77.47 | 33.66,79.38 34.93,80.64 E10.5 | v41.91,83.19 41.91,79.38 33.66,79.38
BB1  (via drill 0.61)
  Top 0.305: E10.6 33.02,82.55 34.29,83.82 34.29,107.95 36.83,110.49 36.83,116.84 38.1,118.11 E16.4 | v15.24,78.11 13.97,78.11 U$1.BB1
  Bottom 0.305: v15.24,78.11 16.51,79.38 31.12,79.38 32.39,80.64 E10.6
BB2  (via drill 0.61)
  Top 0.305: v78.74,47.62 78.11,48.26 v78.11,76.83
  Bottom 0.305: v78.74,47.62 89.54,47.62 95.89,41.27 E6.1 | v78.11,76.83 31.75,76.83 31.12,76.2 13.97,76.2 U$1.BB2
BC1  (via drill 0.61)
  Top 0.305: E14.1 71.12,97.79 72.39,96.52 v72.39,95.89 73.03,95.25 73.03,68.58 v72.39,67.94 | v26.67,67.94 25.4,69.22 v25.4,81.28 | v15.24,81.28 13.97,81.28 U$1.BC1
  Bottom 0.305: v72.39,95.89 73.03,96.52 93.98,96.52 95.89,98.42 E15.1 | v26.67,67.94 v72.39,67.94 | v15.24,81.28 v25.4,81.28
BD1  (via drill 0.61)
  Top 0.305: v69.85,84.45 69.85,92.71 69.22,93.34 69.22,97.16 68.58,97.79 E14.2 | v17.15,85.72 13.97,82.55 U$1.BD1
  Bottom 0.305: v69.85,84.45 24.77,84.45 23.5,85.72 v17.15,85.72
BD2  (via drill 0.61)
  Top 0.305: v27.31,69.22 26.67,69.85 v26.67,81.92
  Bottom 0.305: v27.31,69.22 95.25,69.22 95.25,82.55 94.62,83.19 93.98,83.19 93.98,90.17 E15.13 | v26.67,81.92 26.04,82.55 24.13,82.55 23.5,81.92 16.51,81.92 15.88,82.55 13.97,82.55 U$1.BD2
BE1  (via drill 0.61)
  Top 0.305: v68.58,87 68.58,90.17 E14.13 | v15.24,87 13.97,87 U$1.BE1
  Bottom 0.305: v68.58,87 67.95,86.36 29.21,86.36 28.58,87 v15.24,87
BE2  (via drill 0.61)
  Top 0.305: v18.42,69.85 17.78,70.48 v17.78,83.19
  Bottom 0.305: v18.42,69.85 21.59,69.85 22.23,70.48 90.81,70.48 93.35,73.03 E12.13 | v17.78,83.19 15.24,85.72 13.97,85.72 U$1.BE2
BF1  (via drill 0.61)
  Top 0.305: v20.96,108.58 17.78,105.41 17.78,93.98 13.97,90.17 U$1.BF1 | v85.09,104.78 85.09,76.2 86.36,74.93 E12.10
  Bottom 0.305: 33.66,109.86 32.39,108.58 v20.96,108.58 | 33.66,109.86 34.93,111.12 E16.10 | v85.09,104.78 80.01,109.86 33.66,109.86
BF2  (via drill 0.61)
  Top 0.305: v67.31,87.63 67.31,96.52 66.04,97.79 E14.3
  Bottom 0.305: E14.3 66.68,98.42 67.95,97.16 89.54,97.16 90.81,98.42 E15.3 | v67.31,87.63 66.68,87 29.85,87 27.94,88.9 13.97,88.9 U$1.BF2
BH1  (via drill 0.61)
  Top 0.305: v27.31,109.86 25.4,107.95 v25.4,94.61 | v15.24,94.61 13.97,93.34 U$1.BH1
  Bottom 0.305: v27.31,109.86 31.12,109.86 32.39,111.12 E16.9 | v15.24,94.61 v25.4,94.61
BH2  (via drill 0.61)
  Top 0.305: v39.37,88.27 39.37,116.84 40.64,118.11 E16.3 | v22.23,90.17 26.67,85.72 26.67,83.82 29.21,81.28 29.21,80.01 29.85,79.38 31.75,79.38 v31.75,88.27
  Bottom 0.305: E12.3 91.44,82.55 85.09,88.9 40.01,88.9 v39.37,88.27 v31.75,88.27 | v22.23,90.17 20.96,91.44 14.61,91.44 13.97,92.08 U$1.BH2
BJ1  (via drill 0.61)
  Top 0.305: v15.88,95.89 13.97,95.89 U$1.BJ1
  Bottom 0.305: v15.88,95.89 32.39,95.89 34.93,98.42 E13.5
BJ2  (via drill 0.61)
  Top 0.305: v28.58,99.69 28.58,121.28 31.12,121.28 31.75,120.65 31.75,114.3 34.93,114.3 35.56,114.94 35.56,118.11 E16.5 | v82.55,114.94 82.55,110.49 86.36,106.68 86.36,101.6 87.63,100.33 87.63,90.17 87,89.53 87,83.19 86.36,82.55 E12.5
  Bottom 0.305: v28.58,99.69 26.04,97.16 13.97,97.16 U$1.BJ2 | v82.55,114.94 80.65,116.84 58.42,116.84 57.15,118.11 57.15,121.28 37.47,121.28 36.2,120.02 E16.5
BK1  (via drill 0.61)
  Top 0.305: v58.42,102.87 59.69,101.6 59.69,93.98 58.42,92.71 E14.9 | v16.51,102.23 13.97,99.69 U$1.BK1
  Bottom 0.305: v58.42,102.87 57.79,103.5 17.78,103.5 v16.51,102.23
BK2  (via drill 0.61)
  Top 0.305: v36.83,100.97 36.83,97.79 36.2,97.16 36.2,93.34 35.56,92.71 E13.10
  Bottom 0.305: v36.83,100.97 24.77,100.97 22.23,98.42 13.97,98.42 U$1.BK2
BL1  (via drill 0.61)
  Top 0.305: v60.33,104.14 60.33,100.97 60.96,100.33 E14.5 | v15.24,104.14 13.97,102.87 U$1.BL1
  Bottom 0.305: E14.5 61.6,99.69 62.87,100.97 84.46,100.97 85.73,99.69 E15.5 | v15.24,104.14 v60.33,104.14
BL2  (via drill 0.61)
  Top 0.305: v21.59,99.69 v21.59,93.34
  Bottom 0.305: E15.10 85.73,90.81 84.46,89.53 62.87,89.53 61.6,90.81 E14.10 60.33,90.81 59.06,89.53 25.4,89.53 v21.59,93.34 | v21.59,99.69 20.32,100.97 14.61,100.97 13.97,101.6 U$1.BL2
BM1  (via drill 0.61)
  Top 0.305: v83.82,87.63 83.82,90.17 E15.9 | v27.94,85.72 24.13,89.53 24.13,105.41 24.77,106.05 24.77,107.31 22.23,109.86 15.24,109.86 15.24,107.31 13.97,106.05 U$1.BM1
  Bottom 0.305: v83.82,87.63 81.92,85.72 v27.94,85.72
BM2  (via drill 0.61)
  Top 0.305: v61.6,104.78 61.6,102.23 63.5,100.33 E14.4
  Bottom 0.305: v61.6,104.78 60.96,105.41 24.13,105.41 23.5,104.78 16.51,104.78 15.88,105.41 13.97,105.41 U$1.BM2
BN1  (via drill 0.61)
  Top 0.305: v26.04,125.73 24.77,124.46 24.77,119.38 15.88,110.49 13.97,110.49 13.97,109.86 U$1.BN1
  Bottom 0.305: v26.04,125.73 35.56,125.73 38.1,123.19 95.25,123.19 95.25,110.49 94.62,109.86 93.98,109.86 93.98,100.33 E15.2
BN2  (via drill 0.61)
  Top 0.305: v20.96,71.12 20.32,71.75 v20.32,106.05
  Bottom 0.305: v20.96,71.12 81.28,71.12 83.19,73.03 E12.9 | v20.32,106.05 18.42,107.95 13.97,107.95 U$1.BN2
BP1  (via drill 0.61)
  Top 0.305: v74.3,115.57 74.3,116.2 71.76,118.75 E17.1 | v15.88,114.3 13.97,112.39 U$1.BP1
  Bottom 0.305: v74.3,115.57 73.03,114.3 v15.88,114.3
BP2  (via drill 0.61)
  Top 0.305: v87.63,125.73 87.63,101.6 88.9,100.33 E15.4 | v40.64,126.36 27.94,126.36 27.94,120.02 v20.96,113.03
  Bottom 0.305: v87.63,125.73 87,126.36 v40.64,126.36 | v20.96,113.03 13.97,113.03 U$1.BP2
BR1  (via drill 0.61)
  Top 0.305: v64.77,127.64 64.77,121.92 63.5,120.65 E17.4 | v19.69,118.11 19.69,115.57 13.97,115.57 U$1.BR1 | v26.04,120.02 27.31,121.28 v27.31,128.27
  Bottom 0.305: R1.1 88.27,127 65.41,127 v64.77,127.64 27.94,127.64 v27.31,128.27 | v19.69,118.11 21.59,120.02 v26.04,120.02
BR2  (via drill 0.61)
  Top 0.305: v85.09,125.09 85.09,128.27 89.54,128.27 90.17,127.64 90.17,127 96.52,120.65 E18.1 | v39.37,125.09 34.29,125.09 v34.29,115.57
  Bottom 0.305: v39.37,125.09 v85.09,125.09 | v34.29,115.57 13.97,115.57 U$1.BR2
BS1  (via drill 0.61)
  Top 0.305: v55.88,115.57 58.42,113.03 E17.9 | v15.24,116.84 13.97,118.11 U$1.BS1
  Bottom 0.305: v55.88,115.57 54.61,116.84 v15.24,116.84
BS2  (via drill 0.61)
  Top 0.305: v66.04,128.27 66.04,120.65 E17.3 | v25.4,128.27 22.23,125.09 22.23,124.46 v17.15,119.38
  Bottom 0.305: E17.3 66.68,118.75 67.95,117.47 89.54,117.47 90.81,118.75 E18.3 | v66.04,128.27 64.77,129.54 26.67,129.54 v25.4,128.27 | v17.15,119.38 13.97,119.38 U$1.BS2
BT2  (via drill 0.61)
  Top 0.305: v82.55,121.28 82.55,116.84 86.36,113.03 E18.10
  Bottom 0.305: E17.10 61.6,112.39 62.87,113.67 84.46,113.67 85.73,112.39 E18.10 | v82.55,121.28 81.92,121.92 25.4,121.92 23.5,123.83 15.88,123.83 14.61,122.56 13.97,122.56 U$1.BT2
BU1  (via drill 0.61)
  Top 0.305: v15.24,125.09 13.97,125.09 U$1.BU1
  Bottom 0.305: v15.24,125.09 15.88,124.46 27.94,124.46 29.85,122.56 92.71,122.56 92.71,118.11 91.44,116.84 90.17,116.84 90.17,110.49 89.54,109.86 85.73,109.86 84.46,111.12 E18.9
BU2  (via drill 0.61)
  Top 0.305: v20.32,125.73 20.32,130.18 50.17,130.18 60.33,120.02 E17.5
  Bottom 0.305: v20.32,125.73 19.69,126.36 13.97,126.36 13.97,125.73 U$1.BU2
BV1
  Top 0.305: E18.5 86.36,120.65 86.36,121.92 78.74,129.54 62.23,129.54 62.23,118.11 61.6,117.47 57.15,117.47 57.15,120.65 48.26,129.54 21.59,129.54 21.59,125.09 20.96,124.46 16.51,124.46 16.51,125.73 13.97,128.27 U$1.BV1
BV2
  Top 0.305: E18.4 88.9,120.65 88.9,123.83 R2.1
  Bottom 0.305: R2.1 88.27,124.46 87.63,123.83 38.74,123.83 35.56,127 13.97,127 U$1.BV2
GND  (via drill 0.61)
  Top 0.305: 80.01,38.1 80.01,22.86 81.28,21.59 E3.7 | 80.01,38.1 81.28,39.37 E6.7 | 80.01,38.1 80.01,55.88 81.28,57.15 E9.7 81.28,59.69 80.01,60.96 80.01,83.82 | 80.01,83.82 81.28,82.55 E12.7 | 80.01,83.82 80.01,96.52 81.28,97.79 E15.7 81.28,100.33 79.38,102.23 79.38,116.2 81.28,118.11 E18.7 | R6.1 99.7,27.94 106.05,27.94 C8.- 106.05,28.57 106.05,40.01 C7.- 106.05,41.27 104.78,42.55 104.78,66.67 | 104.78,66.67 106.05,67.94 C6.- | 104.78,66.67 104.78,122.56 106.05,123.83 C5.- | 53.98,17.14 43.82,6.99 43.82,5.71 C9.- | 53.98,17.14 55.88,19.05 E2.7 | 53.98,37.47 55.88,39.37 E5.7 | 53.98,37.47 53.98,17.14 | 54.61,55.88 53.98,55.24 53.98,37.47 | 54.61,55.88 55.88,57.15 E8.7 | 54.61,55.88 54.61,78.74 55.88,80.01 E11.7 55.88,82.55 54.61,83.82 54.61,96.52 55.88,97.79 E14.7 55.88,100.33 54.61,101.6 54.61,116.84 55.88,118.11 E17.7 | 29.21,43.18 30.48,41.91 E4.7 | 29.21,43.18 29.21,57.15 29.85,57.78 E7.7 | 29.21,43.18 29.21,22.86 30.48,21.59 E1.7 | v21.59,12.06 22.23,12.7 22.23,19.68 C1.- | U$1.AT1 13.97,52.7 22.23,52.7 22.23,55.24 C2.- 23.5,56.52 24.13,57.15 24.13,67.31 24.77,67.94 24.77,80.01 23.5,81.28 23.5,83.19 C3.- | E10.7 30.48,82.55 29.21,83.82 29.21,96.52 30.48,97.79 E13.7 30.48,100.33 29.21,101.6 29.21,116.84 30.48,118.11 E16.7 | E16.13 43.18,113.03 45.72,115.57 45.72,118.11 E16.1 | U$1.BT1 13.97,120.65 15.88,120.65 15.88,118.75 16.51,118.11 18.42,118.11 18.42,118.75 22.23,122.56 C4.-
  Bottom 0.305: E3.7 81.92,20.95 87.63,26.67 97.16,26.67 98.43,27.94 R6.1 | T1.1 73.03,5.08 71.12,6.99 45.09,6.99 43.82,5.71 C9.- | E1.7 29.85,19.68 23.5,19.68 C1.- | C2.- 23.5,56.52 24.77,57.78 29.85,57.78 E7.7 | v21.59,12.06 14.61,12.06 13.97,11.43 U$1.AC2 | C3.- 23.5,83.19 28.58,83.19 29.85,81.92 E10.7 29.85,80.64 29.21,80.01 13.97,80.01 U$1.BC2 | C4.- 23.5,121.28 28.58,121.28 29.85,120.02 E16.7 31.12,118.75 32.39,117.47 43.82,117.47 45.09,118.75 E16.1 46.36,118.75 55.25,118.75 E17.7 | E6.7 80.65,41.27 79.38,42.55 57.79,42.55 56.52,41.27 E5.7
N$2
  Top 0.305: E12.12 91.44,74.93 90.17,76.2 90.17,88.9 91.44,90.17 E15.12
N$3
  Bottom 0.305: T1.2 76.84,7.62 79.38,5.08 95.89,5.08 R7.2
N$4
  Top 0.305: E12.11 88.9,74.93 87.63,76.2 87.63,88.9 88.9,90.17 E15.11
N$5  (via drill 0.61)
  Top 0.305: v31.75,94.61 31.75,109.22 30.48,110.49 E16.8 | v45.72,94.61 45.72,92.71 E13.14
  Bottom 0.305: E13.14 46.36,90.81 55.25,90.81 E14.8 | v31.75,94.61 v45.72,94.61
N$6  (via drill 0.61)
  Top 0.305: v53.34,94.61 53.34,121.28 40.01,121.28 39.37,120.65 39.37,118.11 38.74,117.47 38.74,113.67 38.1,113.03 E16.11
  Bottom 0.305: v53.34,94.61 60.33,94.61 62.87,92.08 E14.11
N$7  (via drill 0.61)
  Top 0.305: v40.64,108.58 40.64,110.49 E16.12 | v62.23,106.05 64.77,103.5 64.77,93.98 66.04,92.71 E14.12
  Bottom 0.305: v40.64,108.58 43.18,106.05 v62.23,106.05
N$8
  Top 0.305: E12.8 81.28,74.93 82.55,76.2 82.55,88.9 81.28,90.17 E15.8
  Bottom 0.305: E13.2 43.82,98.42 46.36,95.89 70.49,95.89 74.3,92.08 80.65,92.08 E15.8
N$9
  Top 0.305: E2.12 66.04,13.97 67.31,15.24 67.31,30.48 66.04,31.75 E5.12
  Bottom 0.305: 64.14,31.11 60.33,31.11 59.06,32.38 E5.9 | 64.14,31.11 65.41,32.38 E5.12 | 64.14,31.11 81.92,31.11 83.19,32.38 E6.9
N$10
  Top 0.305: E6.12 91.44,31.75 92.71,30.48 92.71,15.24 91.44,13.97 E3.12
  Bottom 0.305: 81.92,14.61 42.55,14.61 41.28,13.34 E1.12 | 81.92,14.61 83.19,13.34 E3.9 | 81.92,14.61 89.54,14.61 90.81,13.34 E3.12
N$11
  Top 0.305: E2.11 63.5,13.97 62.23,15.24 62.23,30.48 60.96,31.75 E5.10 61.6,32.38 62.87,32.38 E5.11
  Bottom 0.305: E6.10 85.73,33.66 84.46,34.92 65.41,34.92 64.14,33.66 E5.11
N$12  (via drill 0.61)
  Top 0.305: v57.15,93.34 57.15,109.22 55.88,110.49 E17.8
  Bottom 0.305: v57.15,93.34 45.09,93.34 43.82,92.08 E13.13
N$13
  Top 0.305: E3.10 87,12.06 88.27,12.06 E3.11 88.9,13.97 90.17,15.24 90.17,30.48 88.9,31.75 E6.11
  Bottom 0.305: E1.11 38.74,12.06 40.64,10.16 71.76,10.16 73.03,11.43 80.01,11.43 80.65,10.79 84.46,10.79 85.73,12.06 E3.10
N$14  (via drill 0.61)
  Top 0.305: v80.65,103.5 81.28,104.14 81.28,110.49 E18.8
  Bottom 0.305: v80.65,103.5 61.6,103.5 59.69,101.6 43.18,101.6 41.28,99.69 E13.3
VCC
  Top 0.305: C4.+ 22.86,106.05 22.86,92.71 20.96,90.81 20.96,73.03 22.23,71.75 22.23,69.22 C3.+ | 36.83,76.2 38.1,77.47 38.1,80.01 E10.4 | 36.83,76.2 35.56,74.93 E10.10 | 36.83,76.2 36.83,96.52 38.1,97.79 E13.4 | E10.13 43.82,73.03 45.09,73.03 E10.14 | E10.14 45.72,74.93 45.72,80.01 E10.1 45.72,82.55 44.45,83.82 44.45,109.22 45.72,110.49 E16.14 | E4.10 35.56,34.29 38.1,36.83 38.1,39.37 E4.4 | E1.14 45.72,13.97 44.45,15.24 44.45,30.48 45.72,31.75 E4.14 45.72,34.29 45.72,39.37 E4.1 45.72,41.91 45.72,49.53 E7.14 45.72,52.07 46.99,53.34 46.99,71.12 45.72,72.39 E10.14 | C1.+ 23.5,5.71 24.77,6.99 24.77,38.73 23.5,40.01 C2.+ | E2.14 71.12,13.97 76.2,19.05 76.2,27.3 R5.2 75.57,27.94 75.57,28.57 71.76,32.38 E5.14 71.12,34.29 72.39,35.56 72.39,45.72 71.12,46.99 71.12,49.53 E8.14 | E8.10 60.96,52.07 63.5,54.61 63.5,57.15 E8.4 | E8.13 69.22,50.16 70.49,50.16 E8.14 | E8.14 71.12,52.07 71.12,57.15 E8.1 71.12,59.69 71.12,72.39 E11.14 71.12,74.93 72.39,76.2 72.39,88.9 71.12,90.17 E14.14 71.12,92.71 69.85,93.98 69.85,109.22 71.12,110.49 E17.14 | R2.2 99.06,125.09 99.06,126.36 R1.2 | E3.14 97.16,12.06 106.05,12.06 C8.+ | R3.2 106.68,8.26 106.68,12.06 C8.+ | E9.10 86.36,52.07 88.9,54.61 88.9,57.15 E9.4 | 95.25,50.16 95.89,50.16 E9.14 96.52,52.07 96.52,57.15 E9.1 96.52,59.69 96.52,72.39 E12.14 | 95.25,50.16 94.62,50.16 E9.13 | 95.25,50.16 95.25,35.56 96.52,34.29 E6.14 | C8.+ 107.32,13.34 109.22,15.24 109.22,29.84 R4.2
  Bottom 0.305: C3.+ 22.23,68.58 17.78,68.58 17.15,69.22 17.15,73.66 13.97,73.66 U$1.BA2 | E10.10 36.2,73.03 37.47,71.75 41.28,71.75 42.55,73.03 E10.13 | C1.+ 22.23,5.08 13.97,5.08 U$1.AA2 | C2.+ 23.5,40.01 24.77,38.73 33.66,38.73 34.29,39.37 34.29,42.55 36.2,42.55 37.47,41.27 E4.4 38.74,41.27 40.01,42.55 43.82,42.55 45.09,41.27 E4.1 | E4.13 43.82,32.38 45.09,32.38 E4.14 | C4.+ 22.23,107.31 20.32,107.31 19.69,107.95 19.69,111.76 27.94,111.76 29.85,113.67 43.82,113.67 45.09,112.39 E16.14 | E8.13 67.95,51.44 66.68,52.7 62.87,52.7 61.6,51.44 E8.10 60.33,50.16 59.06,48.9 47.63,48.9 46.36,50.16 E7.14 | 98.43,109.86 97.16,111.12 E18.14 96.52,113.03 99.06,113.03 99.06,123.83 R2.2 | 98.43,109.86 106.05,109.86 C5.+ | R4.2 108.59,30.48 106.68,32.38 97.16,32.38 E6.14 | C7.+ 106.05,56.52 104.78,57.78 97.16,57.78 E9.1 | 88.27,52.7 87,51.44 E9.10 | 88.27,52.7 92.08,52.7 93.35,51.44 E9.13 | E12.14 97.16,74.3 106.05,83.19 C6.+ 106.05,84.45 103.51,84.45 97.16,90.81 E15.14 96.52,92.71 98.43,92.71 98.43,109.86 | 88.27,52.7 73.03,52.7 71.76,51.44 E8.14

### Text on the board
tPlace: ebc